# EAGLE design dual uln no plane (EAGLE 5.10)
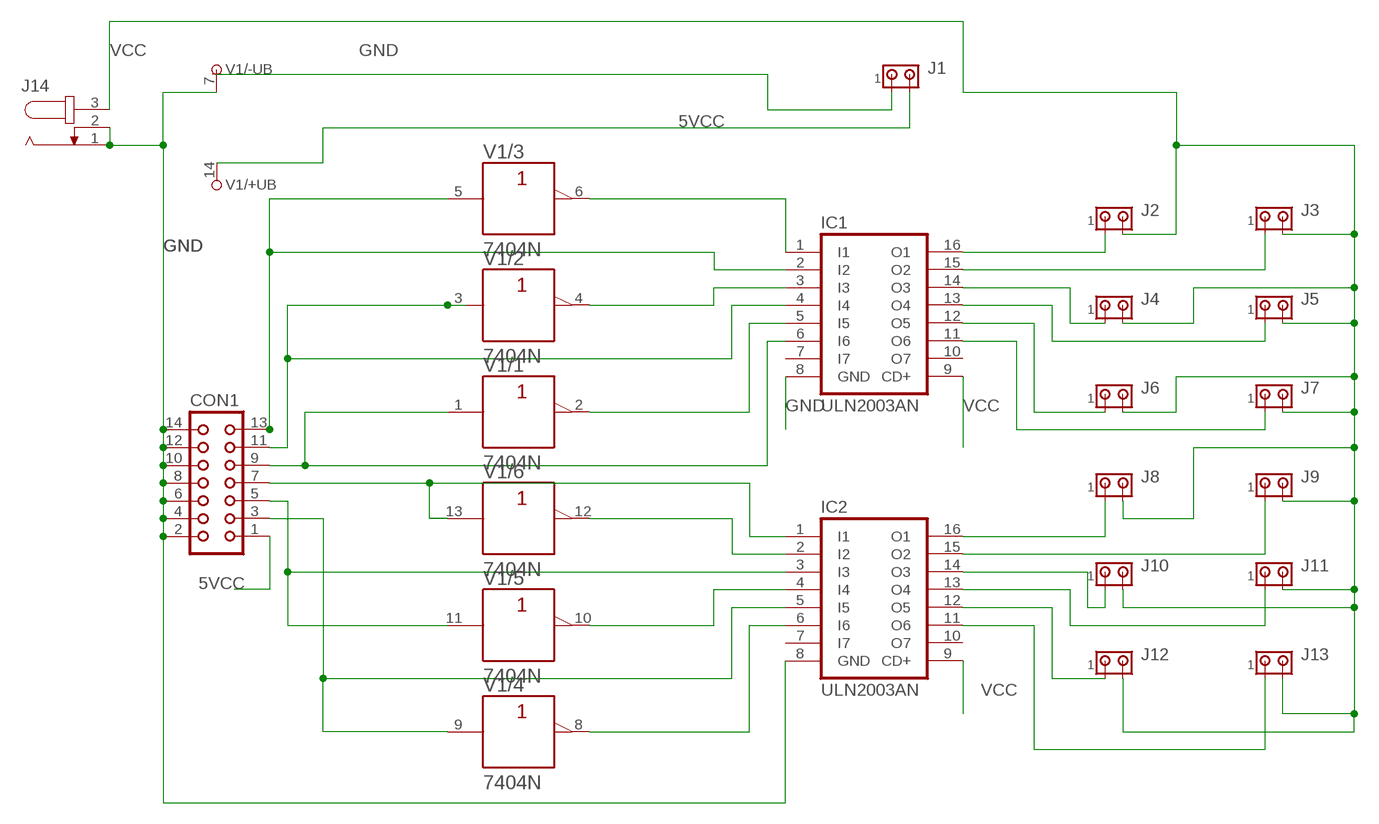
[diagram p0: schematic, sheet 1]

## Parts
CON1  CON14  [CON14]
IC1  ULN2003AN  [DIL16]
IC2  ULN2003AN  [DIL16]
J1  MTA02-100  [10X02MTA]
J2  MTA02-100  [10X02MTA]
J3  MTA02-100  [10X02MTA]
J4  MTA02-100  [10X02MTA]
J5  MTA02-100  [10X02MTA]
J6  MTA02-100  [10X02MTA]
J7  MTA02-100  [10X02MTA]
J8  MTA02-100  [10X02MTA]
J9  MTA02-100  [10X02MTA]
J10  MTA02-100  [10X02MTA]
J11  MTA02-100  [10X02MTA]
J12  MTA02-100  [10X02MTA]
J13  MTA02-100  [10X02MTA]
J14  JACK-PLUG1  [SPC4078]
V1  7404N  [DIL14]

## Nets
5VCC: CON1.1 J1.2 V1.14(/+UB:+UB)
GND: CON1.2 CON1.4 CON1.6 CON1.8 CON1.10 CON1.12 CON1.14 IC1.8(GND) IC2.8(GND) J1.1 J14.1 J14.2 V1.7(/-UB:-UB)
N$1: IC1.3(I3) V1.4(/2:Y)
N$2: IC1.5(I5) V1.2(/1:Y)
N$3: CON1.13 IC1.2(I2) V1.5(/3:A)
N$4: CON1.7 IC2.1(I1) V1.13(/6:A)
N$5: CON1.11 IC1.4(I4) V1.3(/2:A)
N$6: IC1.1(I1) V1.6(/3:Y)
N$7: CON1.9 IC1.6(I6) V1.1(/1:A)
N$9: CON1.5 IC2.3(I3) V1.11(/5:A)
N$10: CON1.3 IC2.5(I5) V1.9(/4:A)
N$12: IC2.2(I2) V1.12(/6:Y)
N$13: IC2.4(I4) V1.10(/5:Y)
N$14: IC2.6(I6) V1.8(/4:Y)
N$15: IC1.16(O1) J2.1
N$16: IC1.15(O2) J3.1
N$17: IC1.14(O3) J4.1
N$18: IC1.13(O4) J5.1
N$19: IC1.12(O5) J6.1
N$20: IC1.11(O6) J7.1
N$21: IC2.16(O1) J8.1
N$22: IC2.15(O2) J9.1
N$23: IC2.14(O3) J10.1
N$24: IC2.13(O4) J11.1
N$25: IC2.12(O5) J12.1
N$26: IC2.11(O6) J13.1
VCC: IC1.9(CD+) IC2.9(CD+) J2.2 J3.2 J4.2 J5.2 J6.2 J7.2 J8.2 J9.2 J10.2 J11.2 J12.2 J13.2 J14.3
Unconnected: IC1.7(I7) IC1.10(O7) IC2.7(I7) IC2.10(O7)

## Library data of the parts
CON1 = con-harting:CON14: CONNECTOR
IC1 IC2 = uln-udn:ULN2003A: DRIVER ARRAY
J1-J13 = con-amp:MTA02-100: AMP connector
J14 = con-jack:JACK-PLUG: DC POWER JACK Power Jack, DC, Right Angle, Through Hole, Rated 5A at 16VDC, PC Terminals Distributor: Farnell (www.Farnell.de) Drawing: 84N1161.pdf / 84N1162.pdf Manufacturer: SPC Technology (www.spctechnology.com) Type: SPC4077 / SPC 4078
V1 = 74ttl-din:74*04: Hex INVERTER

## Board
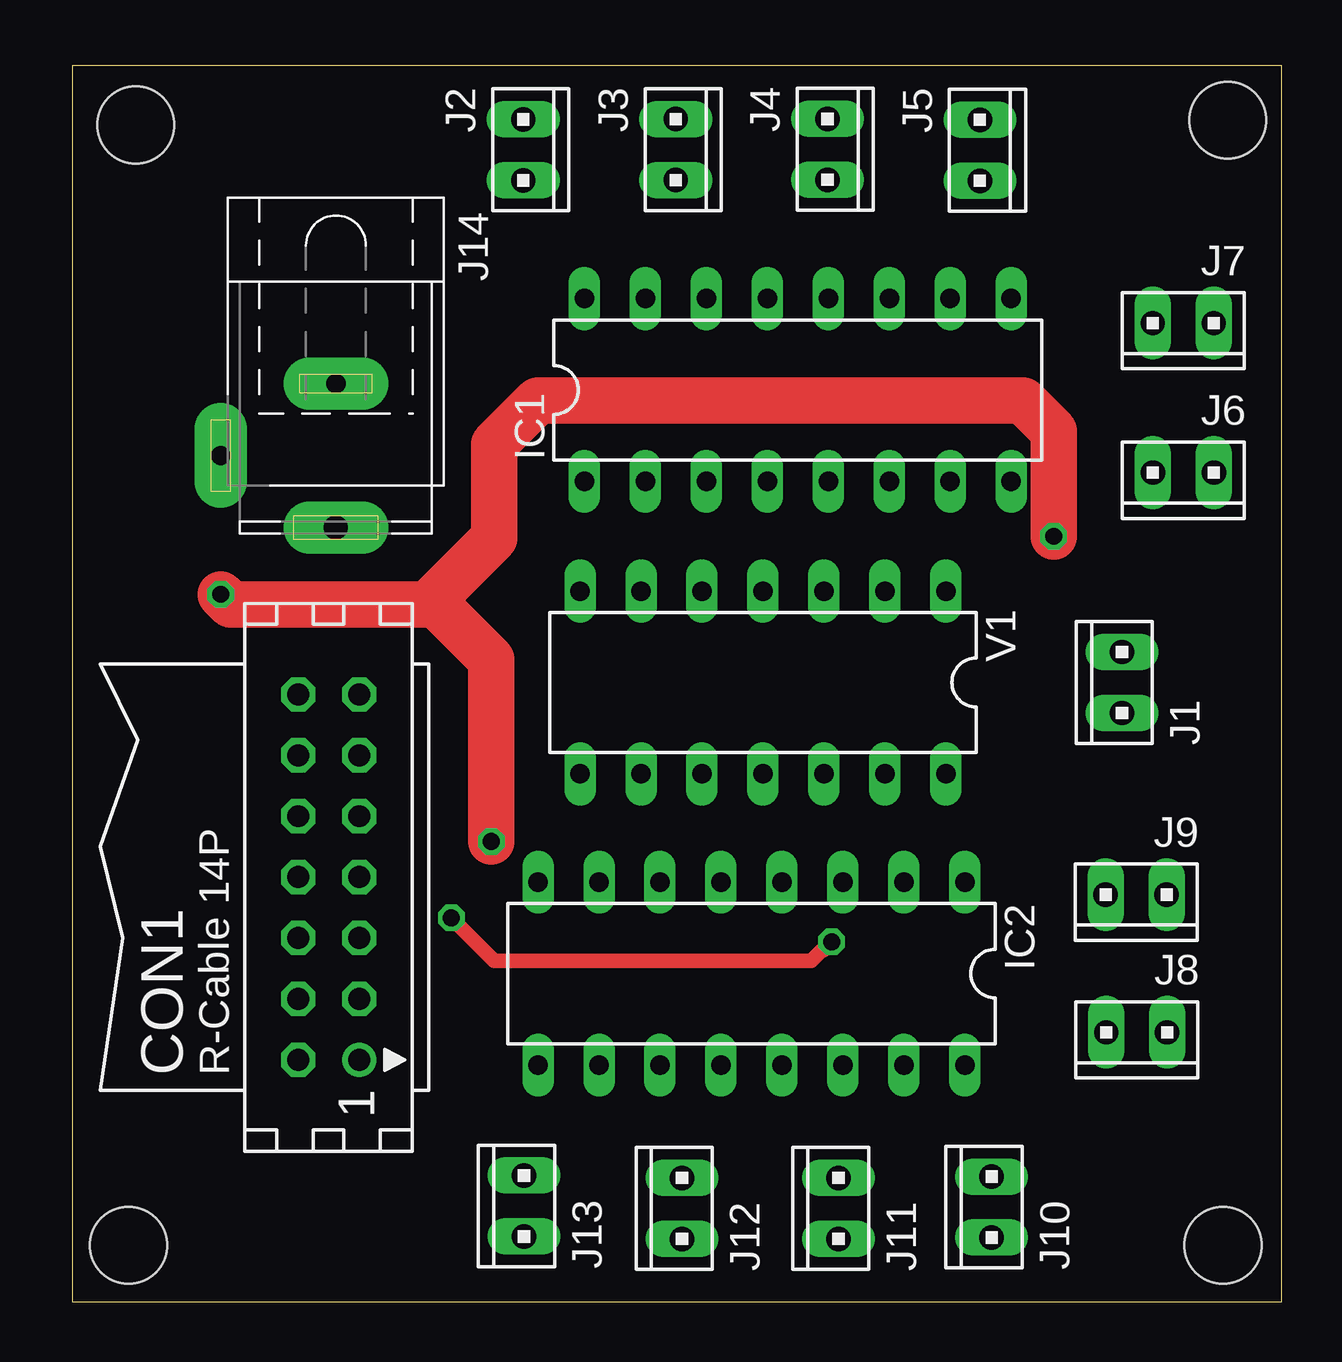
[diagram p1: board, top side]
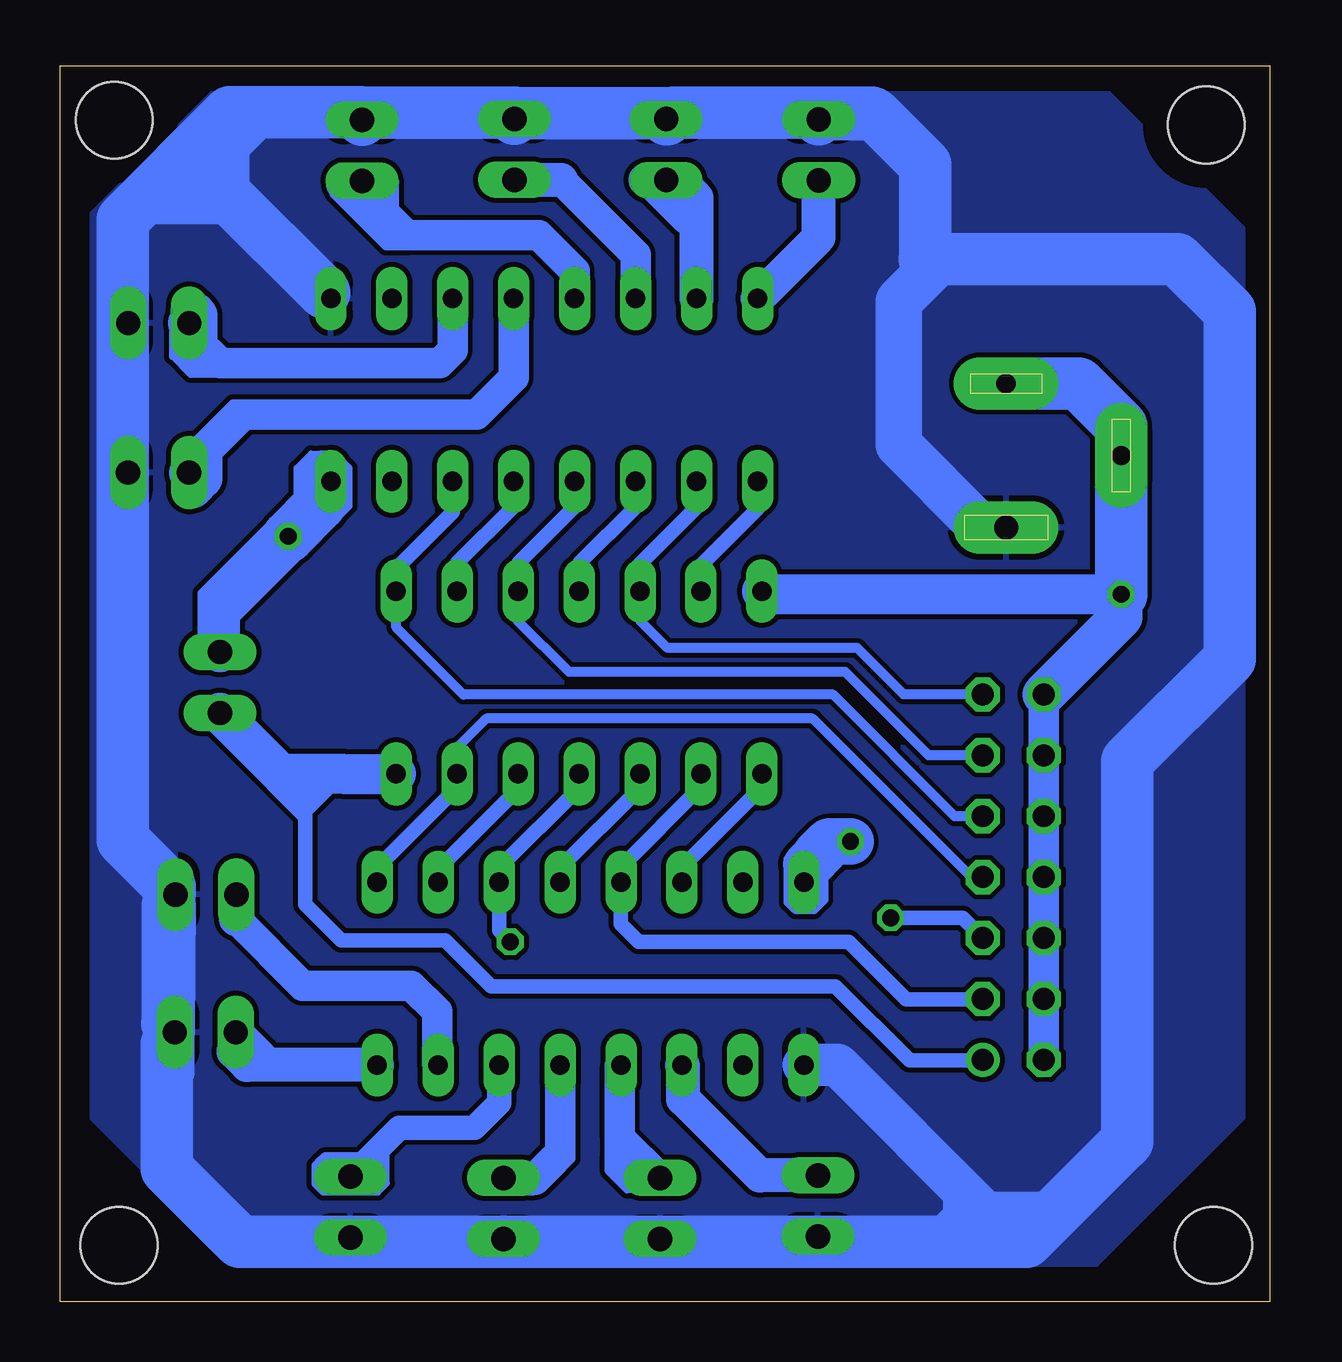
[diagram p2: board, bottom side, seen from below]

Size 50.41 x 51.52 mm. Coordinates in mm from the lower left corner, seen from the top.
Outline: 0,0 50.41,0 50.41,51.52 0,51.52 0,0
Copper layers (1*16): Top 0.035mm / dielectric 1.5mm / Bottom 0.035mm
Design rules "default": minimum track width 10mil, minimum drill 24mil, track to track 8mil, track to pad 8mil, pad to pad 8mil, via to via 8mil, smd to smd 8mil, copper to edge 40mil, drill to drill 8mil, minimum pad ring 10mil, minimum via ring 8mil, stop-mask expansion 4mil, vias tented up to drill 0mil, thermal gap 10mil
Holes 3.2 mm at 2.65,49.06 2.35,2.36 47.95,2.36 48.15,49.26

### Footprints (pad centres in the part's own frame; a part is rotated, then mirrored left to right if it is on the bottom)
CON14 = drill 0.914 round: 1 -7.62,-1.27 | drill 0.914 octagon: 2 -7.62,1.27; 3 -5.08,-1.27; 4 -5.08,1.27; 5 -2.54,-1.27; 6 -2.54,1.27; 7 0,-1.27; 8 0,1.27; 9 2.54,-1.27; 10 2.54,1.27; 11 5.08,-1.27; 12 5.08,1.27; 13 7.62,-1.27; 14 7.62,1.27
DIL16 = drill 0.813 long: 1 -8.89,-3.81; 2 -6.35,-3.81; 3 -3.81,-3.81; 4 -1.27,-3.81; 5 1.27,-3.81; 6 3.81,-3.81; 7 6.35,-3.81; 8 8.89,-3.81; 9 8.89,3.81; 10 6.35,3.81; 11 3.81,3.81; 12 1.27,3.81; 13 -1.27,3.81; 14 -3.81,3.81; 15 -6.35,3.81; 16 -8.89,3.81
10X02MTA = drill 1.016 long: 1 1.27,0; 2 -1.27,0
SPC4078 = drill 0.8 pad 2.184 long: 1 -3,0; 2 0,-4.8 | drill 1 pad 2.184 long: 3 3,0
DIL14 = drill 0.813 long: 1 -7.62,-3.81; 2 -5.08,-3.81; 3 -2.54,-3.81; 4 0,-3.81; 5 2.54,-3.81; 6 5.08,-3.81; 7 7.62,-3.81; 8 7.62,3.81; 9 5.08,3.81; 10 2.54,3.81; 11 0,3.81; 12 -2.54,3.81; 13 -5.08,3.81; 14 -7.62,3.81

### Placement (x,y rotation side)
CON1  10.69,17.71 90 top
IC1  30.24,38.01 0 top
IC2  28.31,13.69 180 top
J1  43.75,25.82 90 top
J2  18.8,48.02 270 top
J3  25.16,48.03 270 top
J4  31.48,48.04 270 top
J5  37.83,48 270 top
J6  46.3,34.57 180 top
J7  46.3,40.8 180 top
J8  44.36,11.24 180 top
J9  44.34,16.98 180 top
J10  38.32,3.96 90 top
J11  31.94,3.9 90 top
J12  25.41,3.9 90 top
J13  18.83,4 90 top
J14  11,35.28 270 top
V1  28.79,25.82 180 top

### Tracks (layer width: path | path; a pad name or v marks a point on that pad's centre or on a via)
5VCC
  Bottom 0.305: 41.25,21.31 40.35,20.41 40.2,20.41 | 40.15,20.51 40.18,20.49 | 40.2,20.01 41.65,21.46
  Bottom 0.61: 38.65,22.01 40.18,20.49 40.2,20.46 40.2,20.41 40.2,20.01 40.2,16.56 38.7,15.06 34.35,15.06 32.45,13.16 18.1,13.16 15,10.06 11.99,10.06 CON1.1 | 40.85,21.56 40.85,21.21 40.15,20.51 40.15,21.01 40.2,21.06 40.7,21.06 41,21.36
  Bottom 1.676: V1.14 38.65,22.01 41.21,22.01 J1.2
GND  (via drill 0.7)
  Top 1.93: v17.47,19.19 17.47,26.78 15.18,29.07 14.82,29.07 | 14.82,29.07 6.62,29.07 v6.2,29.49 | v40.9,31.91 40.9,36.3 39.63,37.57 19.4,37.57 17.58,35.75 17.58,31.83 14.82,29.07
  Bottom 0.254: 38.45,34.36 38.45,34.06 38.35,33.96 | 38.45,34.86 38.45,33.26 38.85,32.86 38.85,32.66 38.35,33.16 38.35,33.96 | 38.45,34.86 38.35,34.76 38.35,33.96 | 38.85,35.26 38.45,34.86 | 38.85,35.26 39.45,35.26 39.55,35.36 39.05,35.36 38.85,35.16 38.85,35.26 | 38.85,35.26 38.95,35.36 39.95,35.36 40.55,34.76 40.55,33.56 44.55,29.56 44.55,27.66 | 44.55,27.56 44.55,27.66 | 44.55,27.56 44.35,27.36 44.15,27.36 | 44.15,27.36 40.45,31.06 41.15,31.06 44.55,27.66 | 44.55,27.56 44.55,27.06 44.25,26.76 | 44.15,27.36 44.02,27.36 J1.1
  Bottom 0.406: 18.6,17.31 18.6,16.76 19,16.36 19.75,16.36 20.05,16.66 20.05,18.46 19.7,18.81 | 18.6,17.31 18.6,17.76 18.65,17.76 18.8,17.91 | 18.6,17.31 19.3,17.31 19.75,16.86 19.7,16.86 19.5,16.66 19.3,16.66 19.2,16.76 19.05,16.76 18.85,16.96
  Bottom 1.016: 19.46,17.75 18.96,17.75 18.8,17.91 18.23,18.48 18.23,18.5 18.65,18.92
  Bottom 1.27: CON1.2 CON1.4 CON1.6 CON1.8 CON1.10 CON1.12 CON1.14 | 19.46,17.75 IC2.8 | v6.2,29.49 6.33,29.63
  Bottom 1.422: v6.2,29.49 15.32,29.49
  Bottom 1.676: 19.46,18.25 19.09,18.62 18.94,18.62 | V1.7 21.03,29.49 v6.2,29.49 | J1.1 43.75,29.07 v40.9,31.91
  Bottom 1.778: v6.2,29.49 6.2,28.55 CON1.14 | IC1.8 39.58,34.2
  Bottom 1.93: 18.94,18.62 18.65,18.92 18.37,19.19 v17.47,19.19
  Bottom 2.184: J14.1 7.96,38.28 6.2,36.52 J14.2 v6.2,29.49 | 39.58,34.2 39.58,33.23 v40.9,31.91
N$1
  Bottom 0.61: IC1.3 26.43,33.14 28.75,30.81 28.75,29.66 V1.4
N$2
  Bottom 0.61: IC1.5 31.51,33.16 33.85,30.81 33.85,29.64 V1.2
N$3
  Bottom 0.406: V1.5 26.25,28.41 25.1,27.26 17.2,27.26 15.27,25.33 CON1.13
  Bottom 0.61: IC1.2 23.89,33.13 26.25,30.76 V1.5
N$4
  Bottom 0.254: 33.9,22.05 V1.13
  Bottom 0.406: CON1.7 12.45,17.71 19.05,24.31 32.65,24.31 33.9,23.06 33.9,22.05
  Bottom 0.61: IC2.1 37.2,18.11 33.87,21.45 V1.13
N$5
  Bottom 0.406: CON1.11 14.23,22.79 17.7,26.26 29.2,26.26 31.35,28.41 31.35,29.6 V1.3
  Bottom 0.61: IC1.4 28.97,33.15 31.3,30.81 31.3,29.65 V1.3
N$6
  Bottom 0.61: IC1.1 21.35,33.07 23.65,30.76 23.65,29.68 V1.6
N$7
  Bottom 0.406: CON1.9 13.14,20.25 18.2,25.31 33.6,25.31 36.4,28.11 V1.1
  Bottom 0.61: IC1.6 34.05,32.92 36.4,30.56 V1.1
N$8
  Bottom 0.254: 36.42,45.47 36.42,46.72 36.72,47.02 36.72,46.21 36.62,46.11 36.62,46.02 36.58,45.98
N$9  (via drill 0.7)
  Top 0.61: v31.65,15.01 31.3,14.66 31.24,14.66 30.79,14.22 17.6,14.22 v15.8,16.01
  Bottom 0.61: V1.11 28.79,21.43 32.15,18.06 32.15,17.53 IC2.3 32.12,15.48 v31.65,15.01 | CON1.5 12.81,16.01 v15.8,16.01
N$10
  Bottom 0.406: 27.05,17.48 IC2.5
  Bottom 0.61: IC2.5 27.05,17.51 27.05,18.11 23.71,21.46 V1.9 | 27.05,17.48 27.05,15.76 26.3,15.01 17.55,15.01 15.15,12.61 11.98,12.61 CON1.3
N$11
  Bottom 0.254: 27.45,5.86 27.45,5.56 27.59,5.7 | 27.59,5.7 27.59,6.09 | 27.59,5.7 27.59,5.44 26.8,4.65 25.36,4.65
N$12
  Bottom 0.61: V1.12 31.33,21.39 34.7,18.01 34.7,17.54 IC2.2
N$13
  Bottom 0.61: V1.10 26.25,21.42 29.6,18.06 29.6,17.52 IC2.4
N$14
  Bottom 0.61: V1.8 21.17,21.45 24.5,18.11 IC2.6
N$15
  Bottom 1.422: J2.1 18.8,44.37 IC1.16
N$16
  Bottom 0.254: 24.65,44.76 24.45,44.76 | 24.65,44.76 26.25,46.36 26.25,46.52 26.02,46.75 | 24.65,44.76 24.45,44.56 24.45,44.86 25.65,46.06
  Bottom 0.305: 24.11,46.2 24.11,45.74 24.32,45.53
  Bottom 1.016: 26.01,46.76 26.02,46.75 25.54,46.75 24.32,45.53
  Bottom 1.422: IC1.15 23.89,46.02 24.57,46.7 24.57,46.66 24.11,46.2 | 26.01,46.76 J3.1
N$17
  Bottom 1.27: IC1.14 26.43,43.66 29.53,46.76 | J4.1
  Bottom 1.422: 29.53,46.76 J4.1
N$18
  Bottom 0.254: 36.73,47.08 36.78,47.08 37.06,47.36 38.77,47.36 38.96,47.17 38.75,47.17 | 38.75,47.17 37.13,47.17 37.07,47.11 37.07,46.8 37.02,46.75 37.02,46.47 36.95,46.4 36.95,46.69 36.87,46.77 | 36.87,46.77 36.87,46.93 36.84,46.96 36.86,46.96 36.9,47 | 38.63,46.6 38.63,47.05 38.75,47.17 | 35.95,43.96 36.85,43.96 39.05,46.16 38.65,46.16 | 38.65,46.16 36.55,44.06 36.75,44.06 38.15,45.46 | 38.65,46.16 38.55,46.16 38.37,46.34 | 36.55,46.26 36.65,46.36 36.65,46.66 36.76,46.66 36.87,46.77
  Bottom 1.27: IC1.13 28.97,42.97 30.47,44.47 35.96,44.47 37.72,46.23
  Bottom 1.422: 37.72,46.23 38.26,46.23 38.37,46.34 38.63,46.6 37.96,46.6 J5.1
N$19
  Bottom 0.254: 45.24,35.49 43.25,37.48 43.24,37.48 43.23,37.49 42.83,37.49 | 42.83,37.49 42.82,37.5 43.22,37.5 43.26,37.46 | 42.83,37.49 42.83,37.07 42.75,36.99
  Bottom 1.27: IC1.12 31.51,38.54 33.05,36.99 42.75,36.99 44.48,35.26
  Bottom 1.676: 44.48,35.26 44.48,34.33 44.9,33.91 44.9,34.44 J6.1
N$20
  Bottom 0.254: 44.79,38.9 45.52,39.63 45.52,39.68 45.13,39.29 45.09,39.29 44.99,39.19 44.79,39.19 44.38,38.78 44.31,38.78 44.34,38.81 44.85,38.81 45.65,39.61 45.65,40.49 45.74,40.4 45.74,39.39 44.98,38.63 43.74,38.63 43.74,39.14 43.81,39.21
  Bottom 1.27: IC1.11 34.05,39.68 34.59,39.13 43.73,39.13 43.81,39.21 44.73,40.13
  Bottom 1.778: 44.73,40.13 44.73,41.1 44.93,41.3 44.93,40.9 J7.1
N$21
  Bottom 1.422: J8.1 42.11,10.26 42.11,10.15 42.4,10.44 43.18,10.44 42.62,9.88 IC2.16
N$22
  Bottom 1.27: 43.07,15.96 40.29,13.18 35.77,13.18 34.7,12.11 34.7,9.92 IC2.15 | J9.1
  Bottom 1.422: 43.07,15.96 J9.1
N$23
  Bottom 0.254: 36.79,6.4 36.79,4.95 37.17,4.57 39.46,4.57 39.82,4.92 39.82,5.71 39.56,5.96 39.55,5.96 39.41,6.1 37.23,6.1 36.99,5.86 36.99,5.47 36.97,5.46 36.97,5.07 37.29,4.76 39.3,4.76 39.61,5.07 39.61,5.6 39.27,5.94 38.37,5.94 38.37,5.95 38.37,5.9 38.93,5.33 38.93,5.5 39.18,5.74 39.2,5.74 39.43,5.52 39.06,5.52 38.85,5.73 38.76,5.73 38.67,5.81 38.93,5.81 38.98,5.76 38.98,5.17 38.86,5.06 38.86,4.95 38.85,4.93 39.18,4.93 39.21,4.96 39.21,5.03 39.38,5.2 39.38,5.28 39.43,5.32 39.17,5.32 39.15,5.3 39.15,5.19 39.12,5.16 39.33,5.16 39.39,5.1 39.39,5.05 39.37,5.03 39.15,5.03 38.87,5.3 38.25,5.3 | 37.13,5.65 37.17,5.62 37.17,5.58 37.32,5.43 37.4,5.43 37.36,5.46 37.3,5.46 37.28,5.44 37.13,5.44 37.34,5.22 37.66,5.22 37.65,5.23 37.24,5.23 37.2,5.18 37.2,5.08 37.21,5.06 37.78,5.06 37.68,4.96 37.37,4.96 37.47,4.87 37.78,4.87 38.21,5.3 38.25,5.3 | J10.1 38.25,5.3
  Bottom 1.016: IC2.14 32.12,8.3 33.15,7.26 36.28,7.26 J10.1
N$24
  Bottom 0.254: 29.15,9.04 29.06,8.96 29.06,5.96 29.1,5.93 29.1,5.92 30.15,4.87 30.15,4.85 29.43,5.58 29.43,6.12 29.46,6.12 29.58,6.24
  Bottom 1.27: IC2.13 29.58,6.24 30.65,5.16
  Bottom 1.422: 30.65,5.16 32.53,5.16 J11.1
N$25
  Bottom 1.27: 25.92,5.4 25.93,5.41 26.6,5.41 27.09,5.9 27.09,6.84 | IC2.12 27.09,9.83 27.09,7.01 27.09,6.84 | J12.1 27.09,6.84
N$26
  Bottom 1.422: J13.1 21.26,5.27 24.45,8.46 24.45,9.83 IC2.11
N$27
  Bottom 0.254: 36.84,46.37 36.84,46.27 36.87,46.24
VCC
  Bottom 0.254: 39.37,42.06 IC1.9
  Bottom 1.016: 13.1,3.66 13.1,5.06 | 13.1,3.66 14.05,2.71 | 11.85,3.71 13.05,3.71 13.1,3.66
  Bottom 1.27: J13.2 25.91,2.83 J12.2 32.83,2.83 J11.2 39.24,2.83 | 39.24,2.83 39.4,2.83 39.72,2.5 | J10.2 39.22,2.85 39.24,2.83
  Bottom 1.422: 45.73,16.5 45.89,16.5 45.92,16.53 | 45.95,11.6 45.95,11.35 J9.2 45.64,11.09 45.51,11.21 45.51,9.56 45.61,9.46 45.61,10.54 45.86,10.79 45.91,10.79 45.96,10.74 | 47.5,45.01 46.49,46.01 | 47.5,45.01 47.57,44.93 | 47.8,45.11 47.7,45.01 47.5,45.01
  Bottom 1.676: J8.2 45.6,16.64 45.73,16.5 | 47.8,43.75 47.57,43.52 J7.2 J6.2 | 39.41,42.06 39.37,42.06
  Bottom 1.778: IC2.9 18.02,9.88 11.85,3.71 8.95,3.71 7.63,5.04
  Bottom 1.93: 7.88,4.78 8.56,4.1 | J14.3 11.04,32.32 12.06,32.32 15.47,35.73 15.47,41.71 13.89,43.29 13.89,43.47
  Bottom 2.184: J2.2 18.8,49.43 18.71,49.51 16.5,49.51 | 45.92,16.53 45.92,11.63 45.95,11.6 | 45.96,10.74 45.96,5.55 43.17,2.76 43.17,2.75 42.92,2.5 39.72,2.5 10.16,2.5 7.88,4.78 7.63,5.04 6.39,6.27 6.37,6.27 5.94,6.7 5.94,22.54 1.68,26.8 1.68,41.29 3.86,43.47 13.89,43.47 14.37,43.47 14.36,43.48 14.36,47.4 16.47,49.51 16.5,49.51 | 16.5,49.51 16.56,49.57 24.83,49.57 25.1,49.3 J3.2 25.16,49.42 25.28,49.54 31.25,49.54 J4.2 31.48,49.55 31.45,49.57 37.53,49.57 J5.2 37.83,49.5 37.91,49.58 42.3,49.58 | 42.3,49.58 43.33,49.58 47.8,45.11 47.8,43.75 47.8,19.26 45.84,17.3 45.84,17.02 45.87,16.99 | 39.41,42.06 43.6,46.25 43.6,48.28 42.3,49.58 | 46.49,46.01 43.33,46.01
  pour Bottom: 0.75,44.36 0.75,8.06 7.25,1.56 42.95,1.56 49.05,7.66 49.05,45.36 43.85,50.56 6.95,50.56